# Altium project uThermometer.PrjPcb
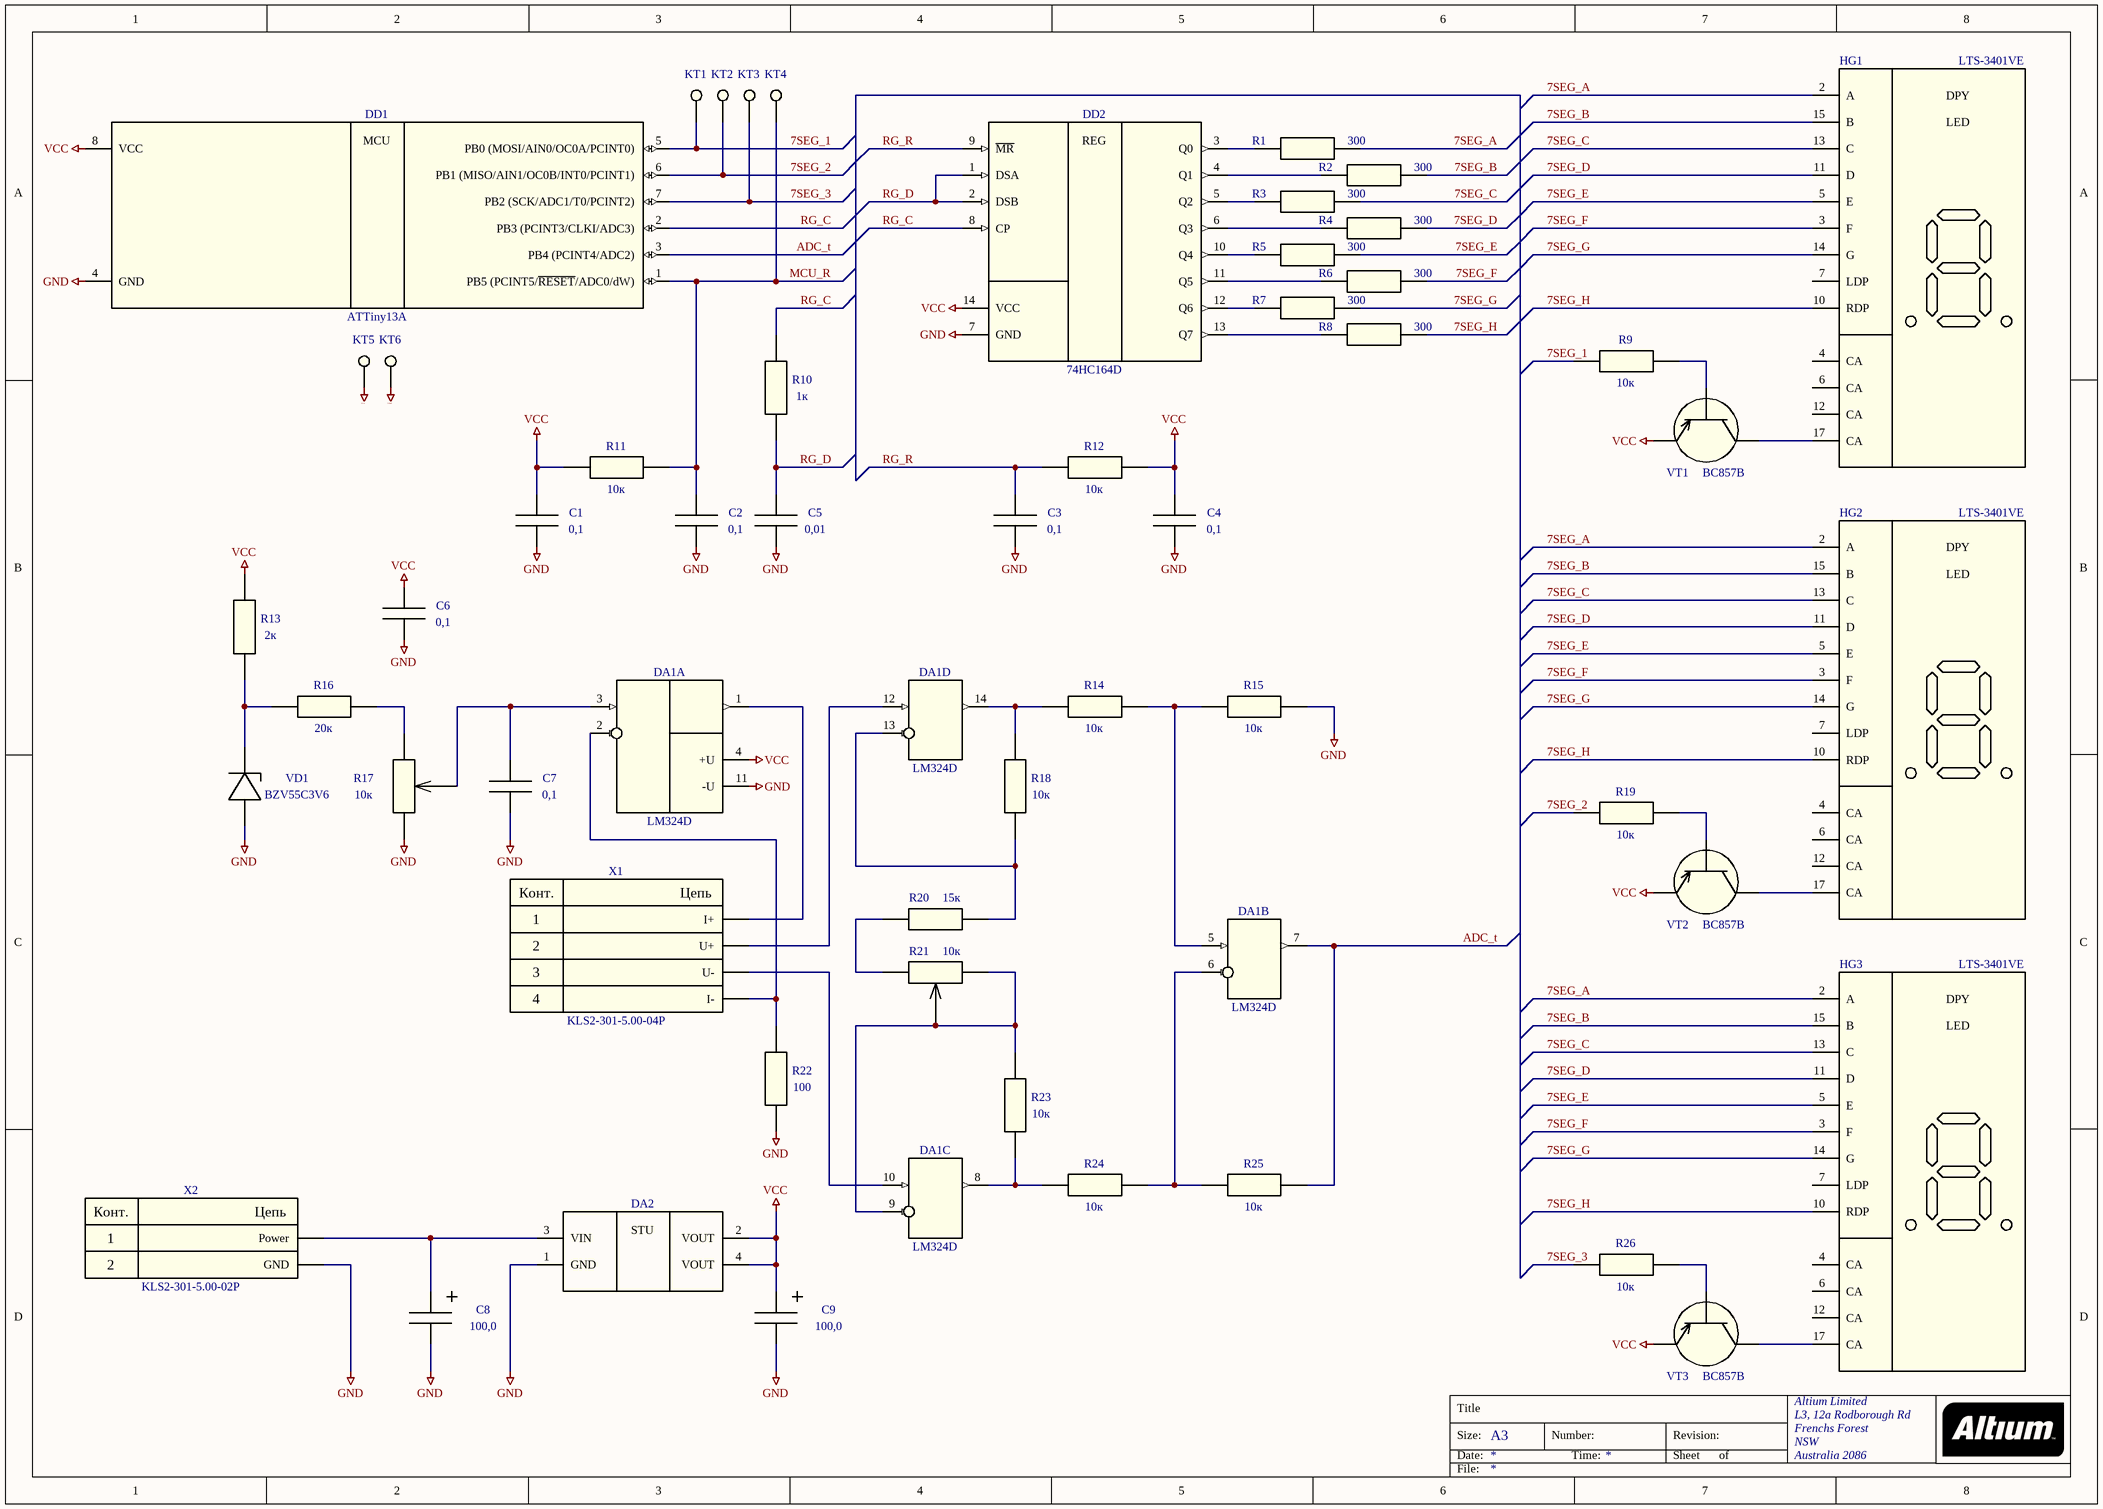
[diagram p0: uThermometer.SchDoc]
1 sheet, 54 parts. Net scope: global (net labels, ports and power ports of the same name join across sheets).
Board file: uThermometer.PcbDoc

## Sheet uThermometer.SchDoc
size A3; Organization: Altium Limited; Address1: L3, 12a Rodborough Rd; Address2: Frenchs Forest; Address3: NSW; Address4: Australia 2086

### Parts
C1  0,1  [Capacitor SMD0805]
C2  0,1  [Capacitor SMD0805]
C3  0,1  [Capacitor SMD0805]
C4  0,1  [Capacitor SMD0805]
C5  0,01  [Capacitor SMD0805]
C6  0,1  [Capacitor SMD0805]
C7  0,1  [Capacitor SMD0805]
C8  100,0  [Capacitor R5V]
C9  100,0  [Capacitor R5V]
DA1  LM324D  [IC LM324D]  (parts A,B,C,D of 4)
DA2  LM1117I-5.0  [IC LM1117I-5.0]  (value not drawn)
DD1  ATTiny13A  [IC ATTiny13A]
DD2  74HC164D  [IC 74HC164D]
HG1  LTS-3401VE  [Indicator LTS3401VE]
HG2  LTS-3401VE  [Indicator LTS3401VE]
HG3  LTS-3401VE  [Indicator LTS3401VE]
KT1  TestPoint 1  [TestPoint 1]  (value not drawn)
KT2  TestPoint 1  [TestPoint 1]  (value not drawn)
KT3  TestPoint 1  [TestPoint 1]  (value not drawn)
KT4  TestPoint 1  [TestPoint 1]  (value not drawn)
KT5  TestPoint 1  [TestPoint 1]  (value not drawn)
KT6  TestPoint 1  [TestPoint 1]  (value not drawn)
R1  300  [Resistor SMD0805]
R2  300  [Resistor SMD0805]
R3  300  [Resistor SMD0805]
R4  300  [Resistor SMD0805]
R5  300  [Resistor SMD0805]
R6  300  [Resistor SMD0805]
R7  300  [Resistor SMD0805]
R8  300  [Resistor SMD0805]
R9  10к  [Resistor SMD0805]
R10  1к  [Resistor SMD0805]
R11  10к  [Resistor SMD0805]
R12  10к  [Resistor SMD0805]
R13  2к  [Resistor SMD0805]
R14  10к  [Resistor SMD0805]
R15  10к  [Resistor SMD0805]
R16  20к  [Resistor SMD0805]
R17  10к  [Resistor 3296W]
R18  10к  [Resistor SMD0805]
R19  10к  [Resistor SMD0805]
R20  15к  [Resistor SMD0805]
R21  10к  [Resistor 3296W]
R22  100  [Resistor SMD0805]
R23  10к  [Resistor SMD0805]
R24  10к  [Resistor SMD0805]
R25  10к  [Resistor SMD0805]
R26  10к  [Resistor SMD0805]
VD1  BZV55C3V6  [Zener BZV55C]
VT1  BC857B  [Transistor SOT23]
VT2  BC857B  [Transistor SOT23]
VT3  BC857B  [Transistor SOT23]
X1  KLS2-301-5.00-04P  [Terminal KLS2-301-5.00-04P]
X2  KLS2-301-5.00-02P  [Terminal KLS2-301-5.00-02P]

### Nets
GND: C1.1 C2.1 C3.1 C4.1 C5.1 C6.1 C7.1 C8.2 C9.2 DA1.11(-U) DA2.1(GND) DD1.4(GND) DD2.7(GND) KT6.1 R15.2 R17.1 R22.1 VD1.1(A) X2.2(GND)
VCC: C1.2 C4.2 C6.2 C9.1(+) DA1.4(+U) DA2.2(VOUT) DA2.4(VOUT) DD1.8(VCC) DD2.14(VCC) KT5.1 R11.1 R12.1 R13.2 VT1.2(E) VT2.2(E) VT3.2(E)
7SEG_1: DD1.5(PB0_(MOSI/AIN0/OC0A/PCINT0)) KT1.1 R9.1
7SEG_2: DD1.6(PB1_(MISO/AIN1/OC0B/INT0/PCINT1)) KT2.1 R19.1
7SEG_3: DD1.7(PB2_(SCK/ADC1/T0/PCINT2)) KT3.1 R26.1
7SEG_A: HG1.2(A) HG2.2(A) HG3.2(A) R1.1
7SEG_B: HG1.15(B) HG2.15(B) HG3.15(B) R2.1
7SEG_C: HG1.13(C) HG2.13(C) HG3.13(C) R3.1
7SEG_D: HG1.11(D) HG2.11(D) HG3.11(D) R4.1
7SEG_E: HG1.5(E) HG2.5(E) HG3.5(E) R5.1
7SEG_F: HG1.3(F) HG2.3(F) HG3.3(F) R6.1
7SEG_G: HG1.14(G) HG2.14(G) HG3.14(G) R7.1
7SEG_H: HG1.10(RDP) HG2.10(RDP) HG3.10(RDP) R8.1
ADC_t: DA1.7(OUTB) DD1.3(PB4_(PCINT4/ADC2)) R25.2
MCU_R: C2.2 DD1.1(PB5_(PCINT5/~{RESET}/ADC0/dW)) KT4.1 R11.2
RG_C: DD1.2(PB3_(PCINT3/CLKI/ADC3)) DD2.8(CP) R10.1
RG_D: C5.2 DD2.1(DSA) DD2.2(DSB) R10.2
RG_R: C3.2 DD2.9(~{MR}) R12.2
NetC7_2: C7.2 DA1.3(+INA) R17.2
NetC8_1: C8.1(+) DA2.3(VIN) X2.1(Power)
NetDA1_1: DA1.1(OUTA) X1.1(I+)
NetDA1_2: DA1.2(-INA) R22.2 X1.4(I-)
NetDA1_5: DA1.5(INB+) R14.2 R15.1
NetDA1_6: DA1.6(INB-) R24.2 R25.1
NetDA1_8: DA1.8(OUTC) R23.1 R24.1
NetDA1_9: DA1.9(INC-) R21.1 R21.2 R23.2
NetDA1_10: DA1.10(INC+) X1.3(U-)
NetDA1_12: DA1.12(IND+) X1.2(U+)
NetDA1_13: DA1.13(IND-) R18.1 R20.2
NetDA1_14: DA1.14(OUTD) R14.1 R18.2
NetDD2_3: DD2.3(Q0) R1.2
NetDD2_4: DD2.4(Q1) R2.2
NetDD2_5: DD2.5(Q2) R3.2
NetDD2_6: DD2.6(Q3) R4.2
NetDD2_10: DD2.10(Q4) R5.2
NetDD2_11: DD2.11(Q5) R6.2
NetDD2_12: DD2.12(Q6) R7.2
NetDD2_13: DD2.13(Q7) R8.2
NetHG1_17: HG1.17(CA) VT1.3(C)
NetHG2_17: HG2.17(CA) VT2.3(C)
NetHG3_17: HG3.17(CA) VT3.3(C)
NetR9_2: R9.2 VT1.1(B)
NetR13_1: R13.1 R16.1 VD1.2(C)
NetR16_2: R16.2 R17.3
NetR19_2: R19.2 VT2.1(B)
NetR20_1: R20.1 R21.3
NetR26_2: R26.2 VT3.1(B)

Not connected (* = marked no-connect by the designer): HG1 4(CA) 6(CA) 7(LDP) 12(CA); HG2 4(CA) 6(CA) 7(LDP) 12(CA); HG3 4(CA) 6(CA) 7(LDP) 12(CA)

### Notes on the sheet
- Title
- Size:
- Date:
- A3
- Number:
- Time:
- Revision:
- Sheet
- of
- File:
- (in symbol IC 74HC164D) REG
- (in symbol IC ATTiny13A) MCU
- (in symbol IC LM1117I-5.0) STU
- (in symbol Indicator LTS-3401VE) DPY; LED
- (in symbol Terminal KLS2-301-5.00-02P) Конт.; Цепь
- (in symbol Terminal KLS2-301-5.00-04P) Конт.; Цепь

### Library data of the parts
C1-C4 C6 C7 = Capacitor C0805_100n: Value: 0,1
C5 = Capacitor C0805_10n: Value: 0,01
C8 C9 = Capacitor R5V: Value: 100,0
DA1 = IC LM324D: Value: LM324D
DA2 = IC LM1117I-5.0: Value: LM1117I-5.0
DD1 = IC ATTiny13A: Value: ATTiny13A
DD2 = IC 74HC164D: Value: 74HC164D
HG1-HG3 = Indicator LTS-3401VE: Value: LTS-3401VE
R1-R8 = Resistor R0805_300_5%: Value: 300
R9 R11 R12 R14 R15 R18 R19 R23-R26 = Resistor R0805_10k_5%: Value: 10к
R10 = Resistor R0805_1k_5%: Value: 1к
R13 = Resistor R0805_2k_5%: Value: 2к
R16 = Resistor R0805_20k_5%: Value: 20к
R17 R21 = Resistor 3296W _10k_1%: Value: 10к
R20 = Resistor R0805_15k_5%: Value: 15к
R22 = Resistor R0805_100_5%: Value: 100
VD1 = Zener BZV55C3V6: Value: BZV55C3V6
VT1-VT3 = Transistor BC857B: Value: BC857B
X1 = Terminal KLS2-301-5.00-04P
X2 = Terminal KLS2-301-5.00-02P